# Altium schematic sheet Power.SchDoc: OpenSCB: POWER
size A4; Organization: OpenSCB; Revision: 0.2; SheetNumber: 3; SheetTotal: 4
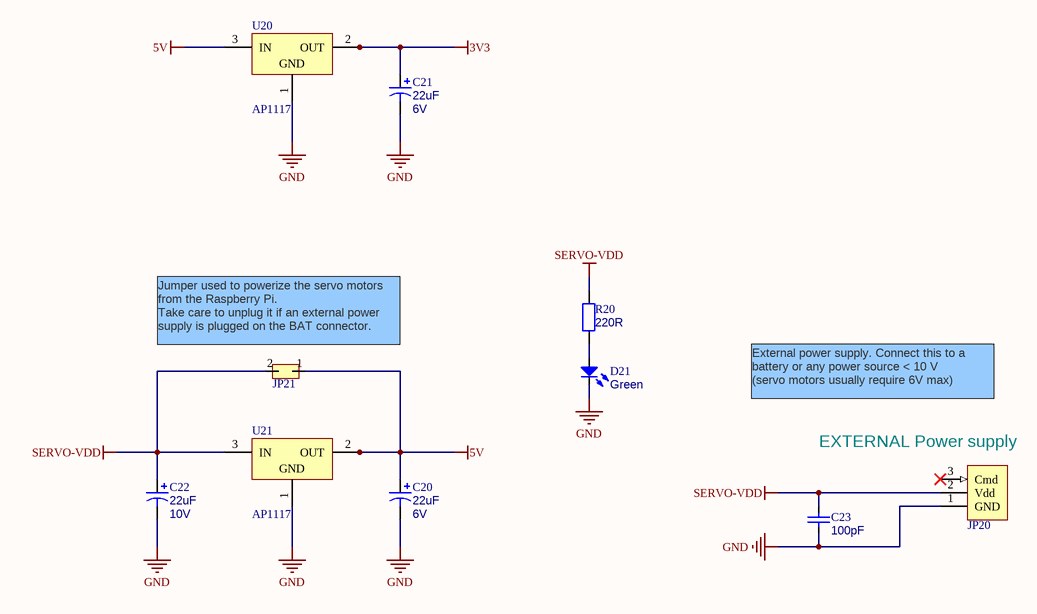
[diagram p0: Power.SchDoc]

## Parts
C20  value 22uF  Voltage: 6V  [TC3216-1206]  (hidden comment: Condensateur Polarise)
C21  value 22uF  Voltage: 6V  [TC3216-1206]  (hidden comment: Condensateur Polarise)
C22  value 22uF  Voltage: 10V  [TC3216-1206]  (hidden comment: Condensateur Polarise)
C23  value 100pF  [CC1005-0402]  (hidden comment: Condensateur)
D21  Color: Green  [DIODE-0603]  (hidden comment: Led)
JP20  SERVO Connector  [PinHead-3pts]  (value not drawn)
JP21  Jumper  [HDR1X2]  (value not drawn)
R20  value 220R  [CR1005-0402]  (hidden comment: Resistance)
U20  AP1117  [SOT-89]
U21  AP1117  [SOT-89]

## Nets
3V3: C21.1 U20.0(OUT) U20.2(OUT)
5V: C20.1 JP21.1 U20.3(IN) U21.0(OUT) U21.2(OUT)
GND: C20.2 C21.2 C22.2 C23.1 D21.2(K) JP20.1(GND) U20.1(GND) U21.1(GND)
SERVO-VDD: C22.1 C23.2 JP20.2(Vdd) JP21.2 R20.2 U21.3(IN)
NetD21_1: D21.1(A) R20.1

Not connected (* = marked no-connect by the designer): JP20 3(Cmd)*

## Notes on the sheet
- (near JP21) Jumper used to powerize the servo motors from the Raspberry Pi.
  Take care to unplug it if an external power supply is plugged on the BAT connector.
- External power supply. Connect this to a battery or any power source < 10 V
  (servo motors usually require 6V max)
- (near JP20) EXTERNAL Power supply
- Title
- Size:
- Date:
- A4
- Number:
- Time:
- Revision:
- Sheet
- of
- File:

## Library data of the parts
JP20 = SERVO-Connector
JP21 = Jumper: Header 2 pts
R20 = Resistance: Precision: 5%; Power: 0.5W
U20 U21 = AP1117: AP1117 - 3V3 Voltage Regulator; Supplier Ref: 1825297; Supplier: Farnell
C20-C22 = Condensateur Polarise: Published: 8-Jun-2000; Revision: July-2002: Re-released for DXP Platform.; Publisher: Altium Limited
C23 = Condensateur: Revision: July-2002: Re-released for DXP Platform.